# Altium schematic sheet GT_16u2_Rev2.SchDoc
size B
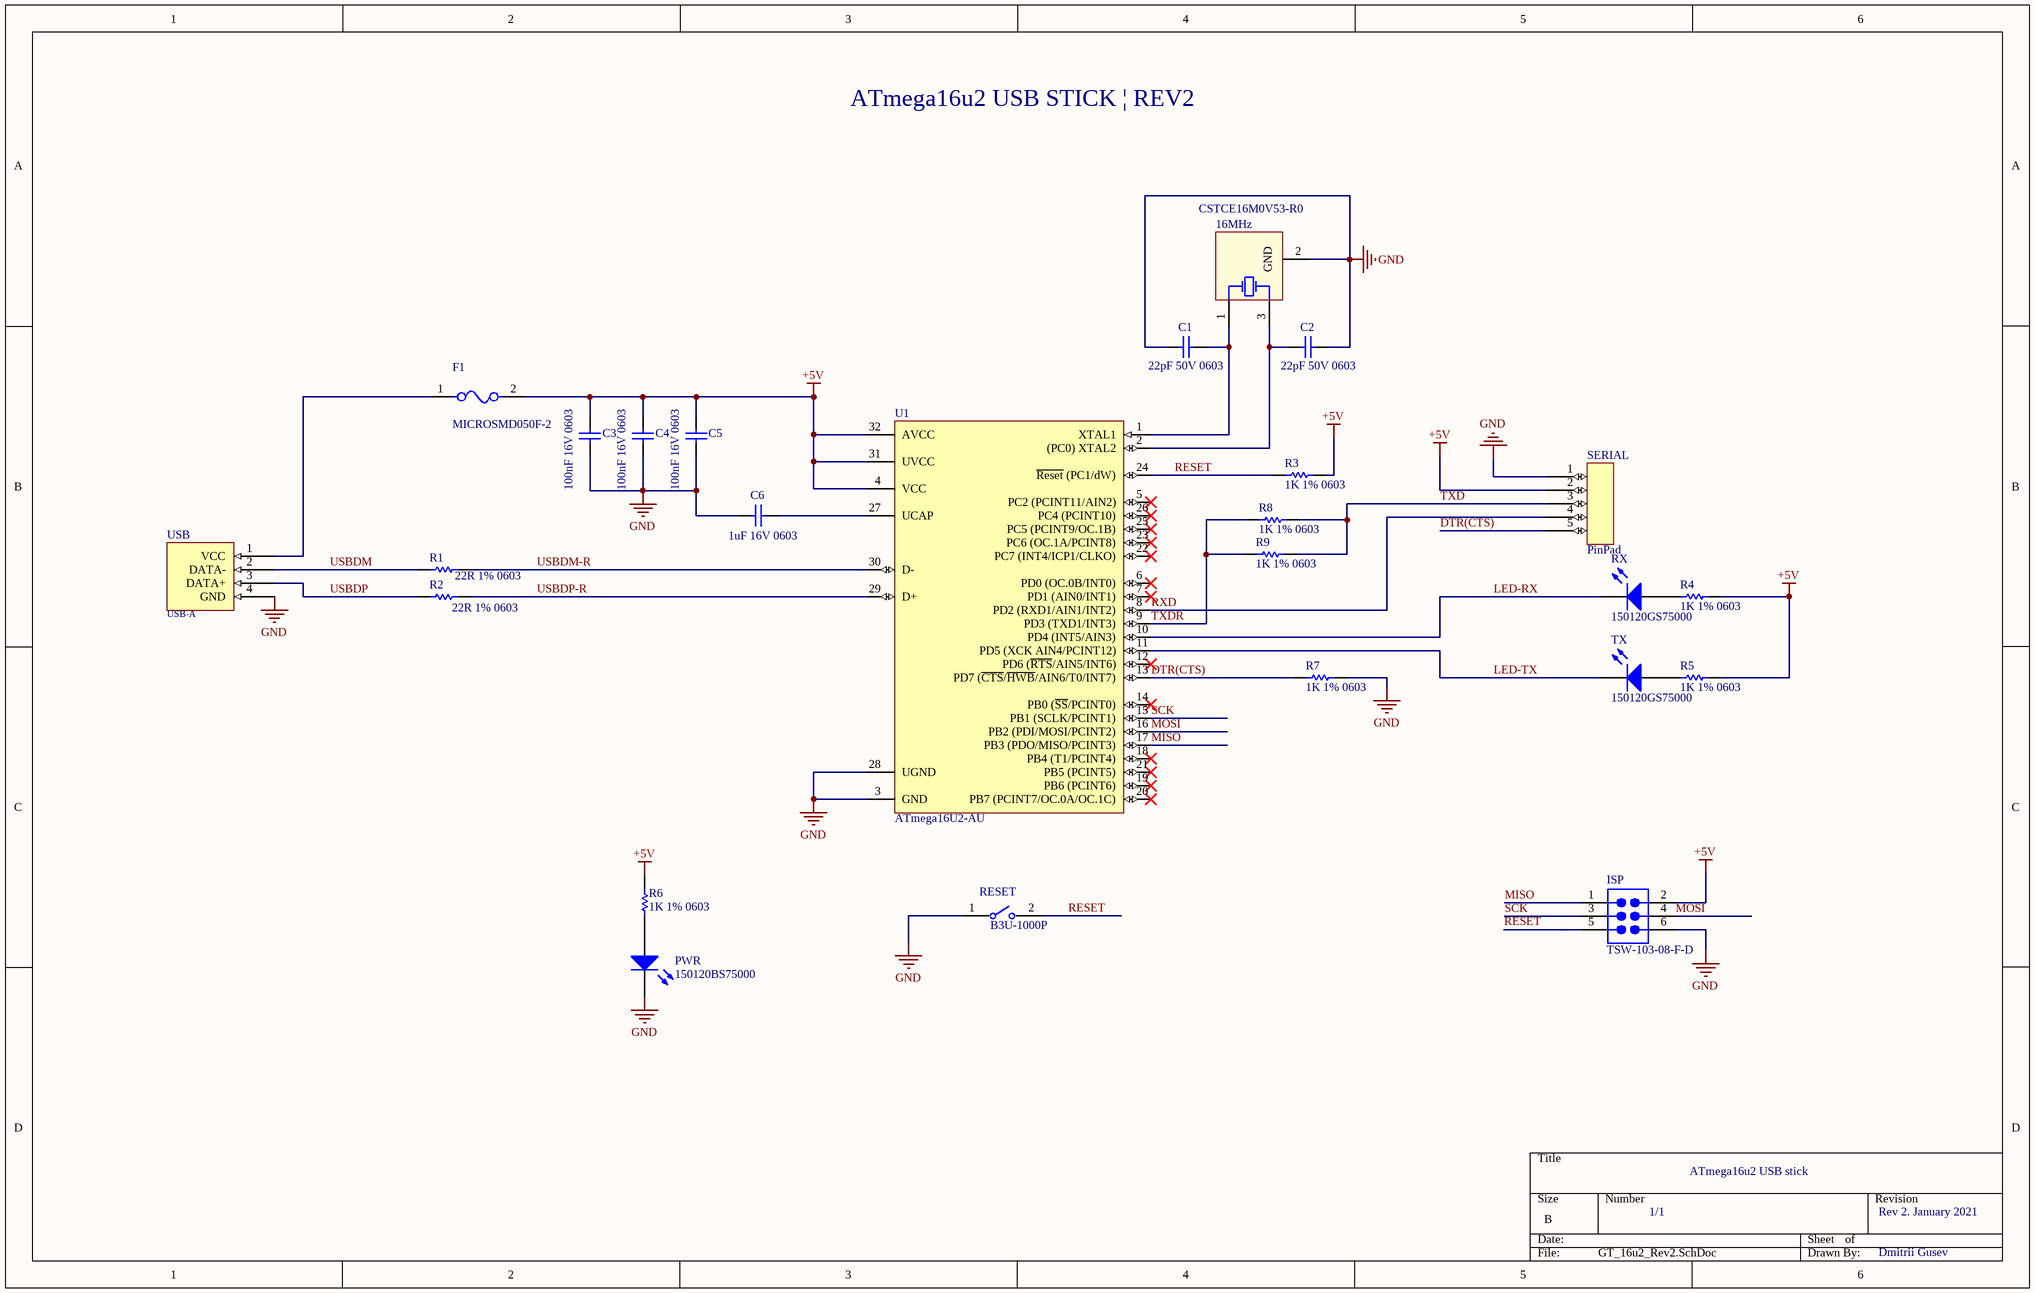
[diagram p0: GT_16u2_Rev2.SchDoc]

## Parts
16MHz  CSTCE16M0V53-R0  [MURA-CSTCE_V-3_V]
C1  22pF 50V 0603  [CAPC1608X90X40ML10T20]
C2  22pF 50V 0603  [CAPC1608X90X40ML10T20]
C3  100nF 16V 0603  [CAPC1608X90X35ML15T15]
C4  100nF 16V 0603  [CAPC1608X90X35ML15T15]
C5  100nF 16V 0603  [CAPC1608X90X35ML15T15]
C6  1uF 16V 0603  [CAPC1608X90X35LL15T15]
F1  MICROSMD050F-2  [FP-microSMD-MFG]
ISP  TSW-103-08-F-D  [SMTC-TSW-103-08-X-D]
PWR  150120BS75000  [1206_A]
R1  22R 1% 0603  [RESC1608X55X25NL10T15]
R2  22R 1% 0603  [RESC1608X55X25NL10T15]
R3  1K 1% 0603  [RESC0603(1608)_L]
R4  1K 1% 0603  [RESC0603(1608)_L]
R5  1K 1% 0603  [RESC0603(1608)_L]
R6  1K 1% 0603  [RESC0603(1608)_L]
R7  1K 1% 0603  [RESC0603(1608)_L]
R8  1K 1% 0603  [RESC0603(1608)_L]
R9  1K 1% 0603  [RESC0603(1608)_L]
RESET  B3U-1000P  [FP-B3U-1000P-MFG]
RX  150120GS75000  [1206_A]
SERIAL  PinPad  [PinPad]
TX  150120GS75000  [1206_A]
U1  ATmega16U2-AU  [32A_M]
USB  USB-A  [USB A]

## Nets
+5V: C3.2 C4.2 C5.2 F1.2 ISP.2 R3.2 R4.2 R5.2 R6.2 SERIAL.2 U1.4(VCC) U1.31(UVCC) U1.32(AVCC)
GND: 16MHz.2(GND) C1.2 C2.1 C3.1 C4.1 C5.1 C6.1 ISP.6 PWR.1(K) R7.1 RESET.1 SERIAL.1 U1.3(GND) U1.28(UGND) USB.4(GND)
DTR(CTS): R7.2 SERIAL.5 U1.13(PD7_(~{CTS}/~{HWB}/AIN6/T0/INT7))
LED-RX: RX.1(K) U1.10(PD4_(INT5/AIN3))
LED-TX: TX.1(K) U1.11(PD5_(XCK_AIN4/PCINT12))
MISO: ISP.1 U1.17(PB3_(PDO/MISO/PCINT3))
MOSI: ISP.4 U1.16(PB2_(PDI/MOSI/PCINT2))
RESET: ISP.5 R3.1 RESET.2 U1.24(~{Reset}_(PC1/dW))
RXD: SERIAL.4 U1.8(PD2_(RXD1/AIN1/INT2))
SCK: ISP.3 U1.15(PB1_(SCLK/PCINT1))
TXD: R8.2 R9.2 SERIAL.3
TXDR: R8.1 R9.1 U1.9(PD3_(TXD1/INT3))
USBDM: R1.1 USB.2(DATA-)
USBDM-R: R1.2 U1.30(D-)
USBDP: R2.1 USB.3(DATA+)
USBDP-R: R2.2 U1.29(D+)
Net16MHz_1: 16MHz.1(C1) C1.1 U1.1(XTAL1)
Net16MHz_3: 16MHz.3(C2) C2.2 U1.2((PC0)_XTAL2)
NetC6_2: C6.2 U1.27(UCAP)
NetF1_1: F1.1 USB.1(VCC)
NetPWR_2: PWR.2(A) R6.1
NetR4_1: R4.1 RX.2(A)
NetR5_1: R5.1 TX.2(A)

Not connected (* = marked no-connect by the designer): U1 5(PC2_(PCINT11/AIN2))* 6(PD0_(OC.0B/INT0))* 7(PD1_(AIN0/INT1))* 12(PD6_(~{RTS}/AIN5/INT6))* 14(PB0_(~{SS}/PCINT0))* 18(PB4_(T1/PCINT4))* 19(PB6_(PCINT6))* 20(PB7_(PCINT7/OC.0A/OC.1C))* 21(PB5_(PCINT5))* 22(PC7_(INT4/ICP1/CLKO))* 23(PC6_(OC.1A/PCINT8))* 25(PC5_(PCINT9/OC.1B))* 26(PC4_(PCINT10))*

## Notes on the sheet
- ATmega16u2 USB STICK | REV2
- ATmega16u2 USB stick
- 1/1
- Rev 2. January 2021
- Dmitrii Gusev

## Library data of the parts
16MHz = CMP-0588-00001-2: Ceramic Resonator, 16 MHz with Built-in Capacitance, Thickness Expander Mode, Initial Frequency Tolerance +/- 0.5%, Load Capacity 15 pF, -20 to 80 degC, 3.2 x 1.3 x 1 mm SMD, RoHS, Reel; Manufacturer: Murata; Oscillating Frequency: 16 MHz; Load Capacity: 15 pF; PackageDescription: 3-Pin SMD, Body 3.2 x 1.3 mm, Pitch 0.95 mm; Mounting Technology: Surface Mount; ComponentLink1URL: http://www.murata.com/; RoHS: TRUE; Packing: Reel; Initial Frequency Tolerance: +/- 0.5%; PartNumber: CSTCE16M0V53-R0; ComponentLink2Description: Datasheet; DatasheetVersion: Rev. P16E-22; PackageReference: CSTCE_V-3; Operating Temperature Range: -20 to 80 degC; ComponentLink2URL: http://www.murata.com/products/catalog/pdf/p16e.pdf; ComponentLink1Description: Manufacturer URL; Initial Tolerance: +/- 0.5%
C1 C2 = CMP-1659-00006-3: Chip Capacitor, 22 pF, +/- 5%, 50 V, -55 to 125 degC, 0603 (1608 Metric), RoHS, Tape and Reel; Mount: Surface Mount; PackageReference: 0603; DatasheetVersion: Rev. 13, 05/2016; RoHSCompliant: true; PackageDescription: 2-Pin Surface Mount Device, Body 1.6 x 0.8 mm; Min Operating Temperature: -55 degC; Length: 1.6 mm; Mounting Technology: Surface Mount; Max Operating Temperature: 125 degC
C3-C5 = CMP-2006-04496-1: Manufacturer: AVX Interconnect / Elco; Part Number: 0603YC104KAZ2A
C6 = CMP-2006-04532-1: Manufacturer: AVX Interconnect / Elco; Part Number: 0603YD105KAT2A
F1 = CMP-08606-000015-1: PTC RESET FUSE 13.2V 500MA 1210; Manufacturer: Littelfuse; Hold Current: 0.5A; Resistance: 0.25-0.9Ω; Trip Time: 0.05s; Value: 0.25-0.9Ω; Trip Current: 1A; Current Rating: 40A; Device Class L3: unset; ComponentLink2URL: https://www.littelfuse.com/~/media/electronics/datasheets/resettable_ptcs/littelfuse_ptc_microsmd_datasheet.pdf.pdf; Temperature: to +85°C; ComponentLink2Description: Datasheet; RoHS: TRUE; Category: Fuse; Ambient Temperature Range Low: -40°C; Lead Free: Yes; Device Class L1: Circuit Protection; Manufacturer Part Number: MICROSMD050F-2; Temperature Range High: +85°C; Ambient Temperature Range High: +85°C; Automotive: No; Height: 0.62mm; Digikey Description: PTC RESET FUSE 13.2V 500MA 1210; Voltage Rating: 13.2V; Package: microSMD; Octopart: https://octopart.com/microsmd050f-2-littelfuse-74214982; Device Class L2: PTC Resettable Fuses
ISP = CMP-1024-00337-1: Manufacturer: Samtec; Pitch: 2.54 mm; ComponentLink1URL: http://www.samtec.com; PackageReference: TSW-103-08-X-D; ComponentLink3Description: Package Specification; PackageDescription: .025[0.64] SQ. Post Terminal Strip Assembly; PartNumber: TSW-103-08-F-D; DatasheetVersion: F-214; ComponentLink1Description: Manufacturer URL; ComponentLink2Description: Datasheet; ComponentLink2URL: http://www.samtec.com/documents/webfiles/pdf/TSW_TH.PDF; PackageVersion: DM, 8/1988; Orientation: Vertical; Mounting Technology: Through-hole; RoHS: True; Temperature Range: -55 to 125 degC; ComponentLink3URL: http://www.samtec.com/documents/webfiles/cpdf/TSW-XXX-XX-XXX-X-XX-XXX-MKT.pdf
PWR = CMP-1426-00015-1: SMD mono-color Chip LED, WL-SMCW, Blue; Manufacturer: Wuerth Elektronik; ComponentLink2Description: Datasheet; ComponentLink1URL: http://www.we-online.com; PartNumber: 150120BS75000; ComponentLink1Description: Manufacturer URL; ComponentLink2URL: http://katalog.we-online.com/led/datasheet/150120BS75000.pdf; PackageReference: 1206_A; Color: Blue
R1 R2 = CMP-1659-00033-1: Chip Resistor, 22 Ohm, +/- 1%, 0.1 W, -55 to 155 degC, 0603 (1608 Metric), RoHS, Tape and Reel; Max Ouput Current: 8 A; Case\Package: SIP; Max Input Voltage: 1.4 V; ComponentLink2URL: http://www.yageo.com/documents/recent/PYu-RC_Group_51_RoHS_L_04.pdf; RoHSCompliant: true; Max Operating Temperature: 100 degC; PackageDescription: 2-Pin Surface Mount Device, Body 1.6 x 0.8 mm; ComponentLink1Description: Manufacturer URL; ComponentLink1URL: http://www.yageo.com/; Length: 18.5 mm; REACH SVHC: Unknown; Pins: 4; DatasheetVersion: Rev. 4, 02/2016; PackageReference: 0603; Output Current: 8 A; Min Operating Temperature: -25 degC; Height: 19.6 mm; Mount: Through Hole; Radiation Hardening: No; ComponentLink2Description: Datasheet; Package Quantity: 200; Packaging: Rail/Tube
R3-R9 = CMP-1012-00074-1: 1K 0.1W 5% 0603 (1608 Metric)  SMD; Case-EIA: 0603; Case-Metric: 1608; Value: 1000.00 Ohm; Technology: SMT; Tolerance: 5 %; Power: 0.1 W
RESET = CMP-2100-03586-2: SWITCH TACTILE SPST-NO 0.05A 12V; Contact Resistance: 100mR; Operating Force: 1.5N; Max Current Rating: 50mA; Switch Travel: 0.15mm; Actuator Type: Standard; Mechanical Life: 200000Cycles; Ratings: Dust Proof; Illumination Type: Non-Illuminated; Throw Configuration: SPST; Actuator Length: 0.4mm; Switch Function: Off-Mom; Height: 1.2mm; Width: 3mm; Weight: 0.000776oz; Contact Material: Silver; Max Voltage Rating (DC): 12V; Insulation Resistance: 100MR; Lead Free: Lead Free; Current Rating: 50mA; Termination: SMD/SMT; Length: 4mm; Voltage Rating (DC): 12V; Contact Current Rating: 50mA; Orientation: Straight; Depth: 2.5mm; Max Operating Temperature: 70°C; Packaging: Tape and Reel; Min Operating Temperature: -25°C; Package Quantity: 1; Mount: Surface Mount; Electrical Life: 200000Cycles
RX TX = CMP-1426-00014-1: SMD mono-color Chip LED, WL-SMCW, Green; Manufacturer: Wuerth Elektronik; PackageReference: 1206_A; PartNumber: 150120GS75000; ComponentLink1Description: Manufacturer URL; ComponentLink2URL: http://katalog.we-online.com/led/datasheet/150120GS75000.pdf; ComponentLink2Description: Datasheet; Color: Green; ComponentLink1URL: http://www.we-online.com
U1 = CMP-0095-00303-2: 8-bit AVR Microcontroller, 2.7-5.5V, 16KB Flash, 512 Bytes EEPROM, 512 Bytes SRAM, 32-pin TQFP, Industrial Grade (-40°C to 85°C); PackageDescription: 32-Lead, 7x7x1.0 mm Body, 0.8mm Lead Pitch, Thin Profile Plastic Quad Flat Package (TQFP); ComponentLink1URL: http://www.atmel.com/; PackageReference: 32A; ComponentLink1Description: Manufacturer URL; DatasheetVersion: revD, Nov-2010; ComponentLink2URL: http://www.atmel.com/dyn/resources/prod_documents/doc7799.pdf; ComponentLink3URL: http://www.atmel.com/dyn/resources/prod_documents/7799S.pdf; ComponentLink3Description: ATmega8U2/16U2/32U2 Summary; ComponentLink2Description: ATmega8U2/16U2/32U2 Datasheet; Code_JEDEC: MS-026-ABA; RevisionNote: DatasheetVersion & PackageVersion updated. URLs added.; PackageVersion: revC, Oct-2010